# Altium schematic sheet Voeding.SchDoc
size A4; SheetNumber: 3; SheetTotal: 4
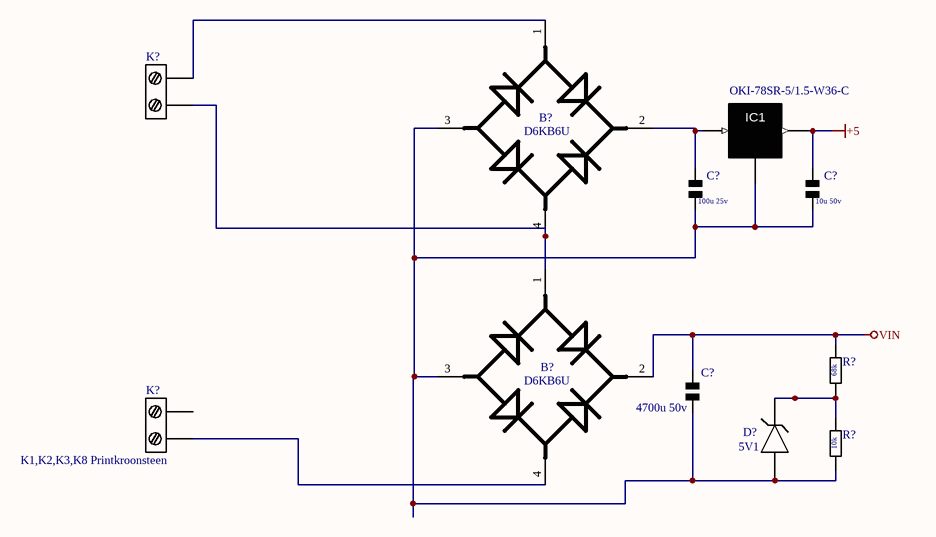
[diagram p0: Voeding.SchDoc]

## Parts
(Parts that share a designator on the sheet are numbered #1, #2 ... from top to bottom, then left to right.)
?  OKI-78SR-5/1.5-W36-C  [OKI-78SR-5/1.5-W36-C]
B?#1  D6KB6U  [D6KB6U - bruggelijk]
B?#2  D6KB6U  [D6KB6U - bruggelijk]
C?#1  100u 25v  [Condensator]
C?#2  10u 50v  [Condensator]
C?#3  4700u 50v  [Condensator]
D?  5V1  [Zenerdiode]
K?#1  (no value)  [K1,K2,K3,K8 Printkroonsteen]
K?#2  K1,K2,K3,K8 Printkroonsteen  [K1,K2,K3,K8 Printkroonsteen]
R?#1  68k  [Resistor]
R?#2  10k  [Resistor]

## Nets
+5: ?.3(OUT) C?#2.2
VIN: B?#2.2(1_~) C?#3.2 R?#1.2
Net?_1: ?.1(IN) B?#1.2(1_~) C?#1.2
Net?_2: ?.2(COM/GND) B?#1.3(2_~) B?#2.3(2_~) C?#1.1 C?#2.1 C?#3.1 D?.2(A) R?#2.1
NetB?#1_1: B?#1.1(+) K?#1.2
NetB?#1_4: B?#1.4(-) B?#2.1(+) K?#1.1
NetB?#2_4: B?#2.4(-) K?#2.1
NetD?_1: D?.1(C) R?#1.1 R?#2.2

Not connected (* = marked no-connect by the designer): K?#2 2

## Notes on the sheet
- (in symbol OKI-78SR-5/1.5-W36-C) IC1

## Library data of the parts
? = OKI-78SR-5/1.5-W36-C: MF: Murata Power; Availability: Unavailable; Price: None; Package: SIP-3 Murata Power; Value: *; SnapEDA_Link: https://www.snapeda.com/parts/OKI-78SR-5/1.5-W36-C/Murata%20Power%20Solutions%20Inc./view-part/229597/?ref=snap; MP: OKI-78SR-5/1.5-W36-C
B?#1 B?#2 = Bruggelijkrichter: Manufacturer: Diodes; Manufacturer Part Number: KBJ608G; Max Junction Temp: +150°C; Max Surge Forward Current: 170A; Reverse Voltage: 800V; Peak Reverse Current: 5uA; Standoff Height: 3.3mm; Value: 80pF; Forward Current: 3A; Max Repetitive Reverse Voltage: 600V; Mouser Description: Bridge Rectifiers 6.0A 800V; Digikey Description: BRIDGE RECT 1PHASE 800V 6A KBJ; ComponentLink2Description: Datasheet; Device Class L1: Discrete Semiconductors; Octopart: https://octopart.com/kbj608g-diodes+inc.-13390835; Temperature Range Low: -65°C; Temperature: -65°C to +150°C; Automotive: No; ComponentLink2URL: https://www.diodes.com/assets/Datasheets/ds21207.pdf; RoHS: TRUE; Category: Diode; Lead Free: Yes; Footprint Url: https://www.diodes.com/assets/Package-Files/KBJ.pdf; Device Class L2: Diodes; Package: KBJ; Device Class L3: Rectifier Diodes; Capacitance: 80pF; Height: 19mm; Temperature Range High: +150°C
C?#1-C?#3 = Condensator: Manufacturer: Kemet; Part Number: C0402C104K4RACTU
D? = Zenerdiode: Zener Voltage: 5.1V; Element Configuration: Single; Impedance: 60R; ESD Protection: No; Voltage Tolerance: 2%; Power Dissipation: 500mW; Max Reverse Leakage Current: 100nA; Test Current: 5mA; Max Operating Temperature: 175°C; Series: -; Package Quantity: 12500; Min Operating Temperature: -65°C; Radiation Hardening: No; RoHS Compliant: Yes; Contact Plating: Tin; Max Power Dissipation: 500mW; Number of Pins: 2; Packaging: Tape and Reel; Mount: Surface Mount; Case/Package: SMD/SMT
K?#1 K?#2 = K1,K2,K3,K8 Printkroonsteen: MF: TE Connectivity; MP: 282837-2; SnapEDA_Link: https://www.snapeda.com/parts/282837-2/TE+Connectivity+AMP+Connectors/view-part/?ref=snap; Price: None; Check_prices: https://www.snapeda.com/parts/282837-2/TE+Connectivity+AMP+Connectors/view-part/?ref=eda; Purchase-URL: https://pricing.snapeda.com/search/part/282837-2/?ref=eda; Value: *; Availability: In Stock; Package: None
R?#1 R?#2 = Resistor: Manufacturer: Vishay Dale; Part Number: CRCW08050000Z0EA